# EAGLE schematic power_sub (EAGLE 7.2.0)
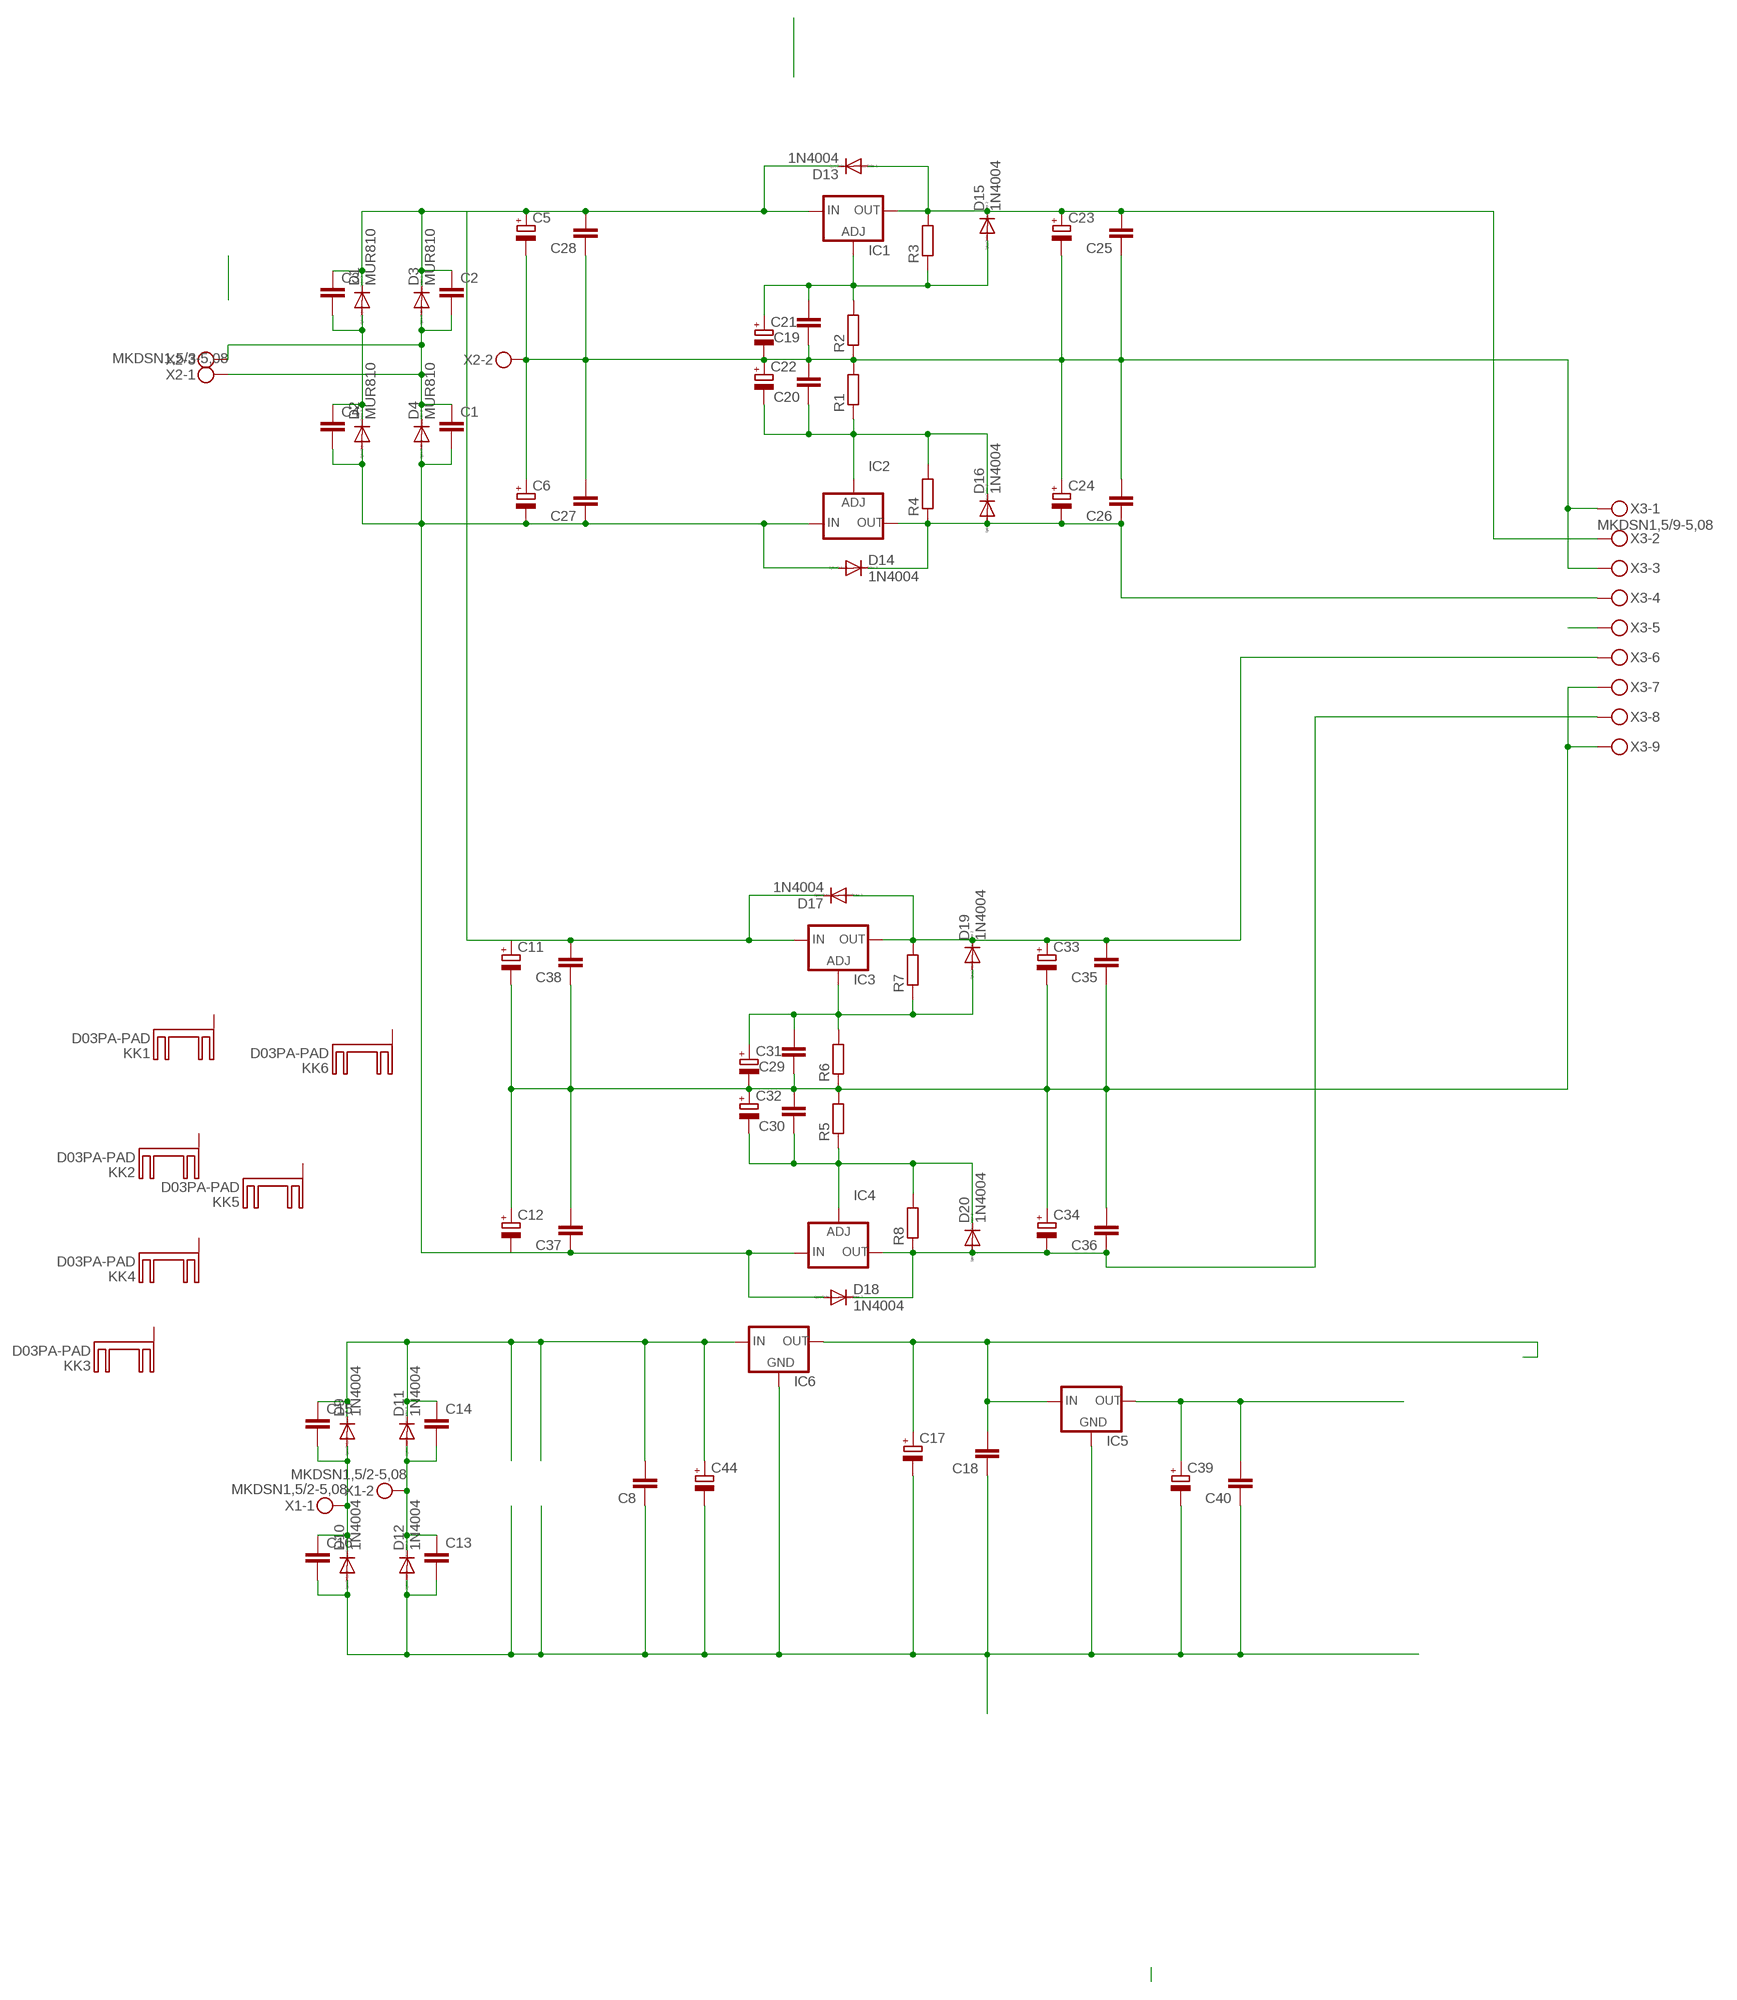
[diagram p0: schematic, sheet 1]

## Parts
C1  C-EU025-025X050  [C025-025X050]
C2  C-EU025-025X050  [C025-025X050]
C3  C-EU025-025X050  [C025-025X050]
C4  C-EU025-025X050  [C025-025X050]
C5  CPOL-EUE7.5-18  [E7,5-18]
C6  CPOL-EUE7.5-18  [E7,5-18]
C8  C-EU050-045X075  [C050-045X075]
C11  CPOL-EUE7.5-18  [E7,5-18]
C12  CPOL-EUE7.5-18  [E7,5-18]
C13  C-EU025-025X050  [C025-025X050]
C14  C-EU025-025X050  [C025-025X050]
C15  C-EU025-025X050  [C025-025X050]
C16  C-EU025-025X050  [C025-025X050]
C17  CPOL-EUE5-10.5  [E5-10,5]
C18  C-EU050-045X075  [C050-045X075]
C19  C-EU050-045X075  [C050-045X075]
C20  C-EU050-045X075  [C050-045X075]
C21  CPOL-EUE5-8.5  [E5-8,5]
C22  CPOL-EUE5-8.5  [E5-8,5]
C23  CPOL-EUE5-10.5  [E5-10,5]
C24  CPOL-EUE5-10.5  [E5-10,5]
C25  C-EU050-045X075  [C050-045X075]
C26  C-EU050-045X075  [C050-045X075]
C27  C-EU050-045X075  [C050-045X075]
C28  C-EU050-045X075  [C050-045X075]
C29  C-EU050-045X075  [C050-045X075]
C30  C-EU050-045X075  [C050-045X075]
C31  CPOL-EUE5-8.5  [E5-8,5]
C32  CPOL-EUE5-8.5  [E5-8,5]
C33  CPOL-EUE5-10.5  [E5-10,5]
C34  CPOL-EUE5-10.5  [E5-10,5]
C35  C-EU050-045X075  [C050-045X075]
C36  C-EU050-045X075  [C050-045X075]
C37  C-EU050-045X075  [C050-045X075]
C38  C-EU050-045X075  [C050-045X075]
C39  CPOL-EUE5-10.5  [E5-10,5]
C40  C-EU050-045X075  [C050-045X075]
C44  CPOL-EUE7.5-18  [E7,5-18]
D1  MUR810  [TO220ACS]
D2  MUR810  [TO220ACS]
D3  MUR810  [TO220ACS]
D4  MUR810  [TO220ACS]
D9  1N4004  [DO41-10]
D10  1N4004  [DO41-10]
D11  1N4004  [DO41-10]
D12  1N4004  [DO41-10]
D13  1N4004  [DO41-10]
D14  1N4004  [DO41-10]
D15  1N4004  [DO41-10]
D16  1N4004  [DO41-10]
D17  1N4004  [DO41-10]
D18  1N4004  [DO41-10]
D19  1N4004  [DO41-10]
D20  1N4004  [DO41-10]
IC1  LM317TS  [317TS]
IC2  LM337TS  [337TS]
IC3  LM317TS  [317TS]
IC4  LM337TS  [337TS]
IC5  78XXS  [78XXS]
IC6  78XXS  [78XXS]
KK1  D03PA-PAD  [D03PA-PAD]
KK2  D03PA-PAD  [D03PA-PAD]
KK3  D03PA-PAD  [D03PA-PAD]
KK4  D03PA-PAD  [D03PA-PAD]
KK5  D03PA-PAD  [D03PA-PAD]
KK6  D03PA-PAD  [D03PA-PAD]
R1  R-EU_0207/12  [0207/12]
R2  R-EU_0207/12  [0207/12]
R3  R-EU_0207/12  [0207/12]
R4  R-EU_0207/12  [0207/12]
R5  R-EU_0207/12  [0207/12]
R6  R-EU_0207/12  [0207/12]
R7  R-EU_0207/12  [0207/12]
R8  R-EU_0207/12  [0207/12]
X1  MKDSN1,5/2-5,08  [MKDSN1,5/2-5,08]
X2  MKDSN1,5/3-5,08  [MKDSN1,5/3-5,08]
X3  MKDSN1,5/9-5,08  [MKDSN1,5/9-5,08]

## Nets
N$1: C2.1 C3.1 C5.+ C28.2 C38.2 D1.C D3.C D13.C D17.C IC1.3(IN) IC3.3(IN)
N$2: C3.2 C4.1 D1.A D2.C
N$3: C39.+ C40.2 IC5.OUT
N$4: C1.1 C2.2 D3.A D4.C X2.1 X2.3
N$6: X3.5
N$10: C11.- C12.+ C29.1 C30.2 C31.- C32.+ C33.- C34.+ C35.1 C36.2 C37.2 C38.1 R5.2 R6.1 X3.7 X3.9
N$11: C8.2 C14.1 C15.1 C44.+ D9.C D11.C IC6.IN
N$12: C15.2 C16.1 D9.A D10.C X1.1
N$13: C8.1 C13.2 C16.2 C17.- C18.1 C39.- C40.1 C44.- D10.A D12.A IC5.GND IC6.GND
N$14: C13.1 C14.2 D11.A D12.C X1.2
N$16: C1.2 C4.2 C6.- C27.1 C37.1 D2.A D4.A D14.A D18.A IC2.2(IN) IC4.2(IN)
N$17: C23.+ C25.2 D13.A D15.C IC1.2(OUT) R3.2 X3.2
N$18: C33.+ C35.2 D17.A D19.C IC3.2(OUT) R7.2 X3.6
N$19: C20.1 C22.- D16.C IC2.1(ADJ) R1.1 R4.2
N$20: C19.2 C21.+ D15.A IC1.1(ADJ) R2.2 R3.1
N$21: C5.- C6.+ C19.1 C20.2 C21.- C22.+ C23.- C24.+ C25.1 C26.2 C27.2 C28.1 R1.2 R2.1 X2.2 X3.1 X3.3
N$22: C30.1 C32.- D20.C IC4.1(ADJ) R5.1 R8.2
N$23: C29.2 C31.+ D19.A IC3.1(ADJ) R6.2 R7.1
N$24: C17.+ C18.2 IC5.IN IC6.OUT
N$25: C24.- C26.1 D14.C D16.A IC2.3(OUT) R4.1 X3.4
N$26: C34.- C36.1 D18.C D20.A IC4.3(OUT) R8.1 X3.8
Unconnected: C11.+ C12.- KK1.B(K) KK2.B(K) KK3.B(K) KK4.B(K) KK5.B(K) KK6.B(K)

## Library data of the parts
C1-C4 C8 C13-C16 C18-C20 C25-C30 C35-C38 C40 = Vwvwbg:C-EU: CAPACITOR, European symbol
C5 C6 C11 C12 C17 C21-C24 C31-C34 C39 C44 = Vwvwbg:CPOL-EU: POLARIZED CAPACITOR, European symbol
D1-D4 = diode:MUR810: DIODE
D9-D20 = diode:1N4004: DIODE general purpose rectifier, 1 A
IC1 IC3 = v-reg:LM317TS: VOLTAGE REGULATOR
IC2 IC4 = v-reg:LM337TS: VOLTAGE REGULATOR
IC5 IC6 = v-reg:78XXS: VOLTAGE REGULATOR
KK1-KK6 = heatsink:D03PA-PAD: HEATSINK distributor Schukat
R1-R8 = Vwvwbg:R-EU_: RESISTOR, European symbol
X1 = con-phoenix-508:MKDSN1,5/2-5,08: MKDSN 1,5/ 2-5,08 Printklemme Nennstrom: 13,5 A Nennspannung: 250 V Rastermaß: 5,08 mm Polzahl: 2 Anschlussart: Schraubanschluss Montage: Löten Anschlussrichtung Leiter/Platine: 0 ° Artikelnummer: 1729128 Source: http://eshop.phoenixcontact.com .. 1729128.pdf
X2 = con-phoenix-508:MKDSN1,5/3-5,08: MKDSN 1,5/ 3-5,08 Printklemme Nennstrom: 13,5 A Nennspannung: 250 V Rastermaß: 5,08 mm Polzahl: 3 Anschlussart: Schraubanschluss Montage: Löten Anschlussrichtung Leiter/Platine: 0 ° Artikelnummer: 1729131 Source: http://eshop.phoenixcontact.com .. 1729131.pdf
X3 = con-phoenix-508:MKDSN1,5/9-5,08: MKDSN 1,5/ 9-5,08 Printklemme Nennstrom: 13,5 A Nennspannung: 250 V Rastermaß: 5,08 mm Polzahl: 9 Anschlussart: Schraubanschluss Montage: Löten Anschlussrichtung Leiter/Platine: 0 ° Artikelnummer: 1729199 Source: http://eshop.phoenixcontact.com .. 1729199.pdf